# EAGLE design PCB board (EAGLE 9.5.2)
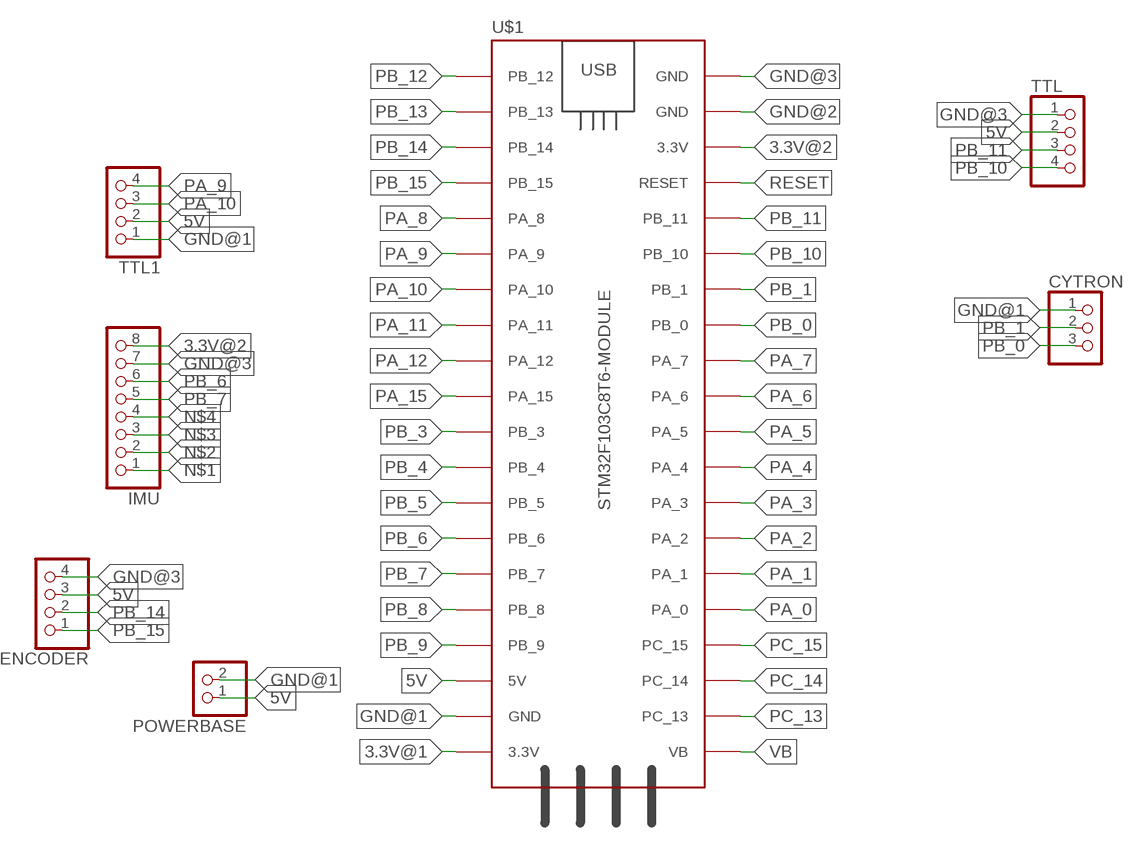
[diagram p0: schematic, sheet 1]

## Parts
CYTRON  PINHD-1X3  [1X03]
ENCODER  PINHD-4_DATA  [1X04_DATA]
IMU  PINHD-1X8  [1X08]
POWERBASE  PINHD-1X2  [1X02]
TTL  PINHD-4_DATA  [1X04_DATA]
TTL1  PINHD-4_DATA  [1X04_DATA]
U$1  STM32F103C8T6-MODULE  [STM32F103C8T6-MODULE]

## Nets
3.3V@1: U$1.3.3V_1(3.3V)
3.3V@2: IMU.8 U$1.3.3V_2(3.3V)
5V: ENCODER.3 POWERBASE.1 TTL1.2 TTL.2 U$1.5V
GND@1: CYTRON.1 POWERBASE.2 TTL1.1 U$1.GND_1(GND)
GND@2: U$1.GND_2(GND)
GND@3: ENCODER.4 IMU.7 TTL.1 U$1.GND_3(GND)
N$1: IMU.1
N$2: IMU.2
N$3: IMU.3
N$4: IMU.4
PA_0: U$1.PA_0
PA_1: U$1.PA_1
PA_2: U$1.PA_2
PA_3: U$1.PA_3
PA_4: U$1.PA_4
PA_5: U$1.PA_5
PA_6: U$1.PA_6
PA_7: U$1.PA_7
PA_8: U$1.PA_8
PA_9: TTL1.4 U$1.PA_9
PA_10: TTL1.3 U$1.PA_10
PA_11: U$1.PA_11
PA_12: U$1.PA_12
PA_15: U$1.PA_15
PB_0: CYTRON.3 U$1.PB_0
PB_1: CYTRON.2 U$1.PB_1
PB_3: U$1.PB_3
PB_4: U$1.PB_4
PB_5: U$1.PB_5
PB_6: IMU.6 U$1.PB_6
PB_7: IMU.5 U$1.PB_7
PB_8: U$1.PB_8
PB_9: U$1.PB_9
PB_10: TTL.4 U$1.PB_10
PB_11: TTL.3 U$1.PB_11
PB_12: U$1.PB_12
PB_13: U$1.PB_13
PB_14: ENCODER.2 U$1.PB_14
PB_15: ENCODER.1 U$1.PB_15
PC_13: U$1.PC_13
PC_14: U$1.PC_14
PC_15: U$1.PC_15
RESET: U$1.RESET
VB: U$1.VB

## Library data of the parts
CYTRON = MIA_LIBRARY-2-2-2:PINHD-1X3: PIN HEADER
ENCODER TTL TTL1 = MIA_LIBRARY-2-2-2:PINHD-4_DATA: PIN HEADER
IMU = MIA_LIBRARY-2-2-2:PINHD-1X8: PIN HEADER
POWERBASE = MIA_LIBRARY-2-2-2:PINHD-1X2: PIN HEADER
U$1 = MIA_LIBRARY-2-2-2:STM32F103C8T6-MODULE: STM32F103C8T6 module with ARM Cortex-3, 20kB SRAM, 64kB Flash, 72MHz

## Board
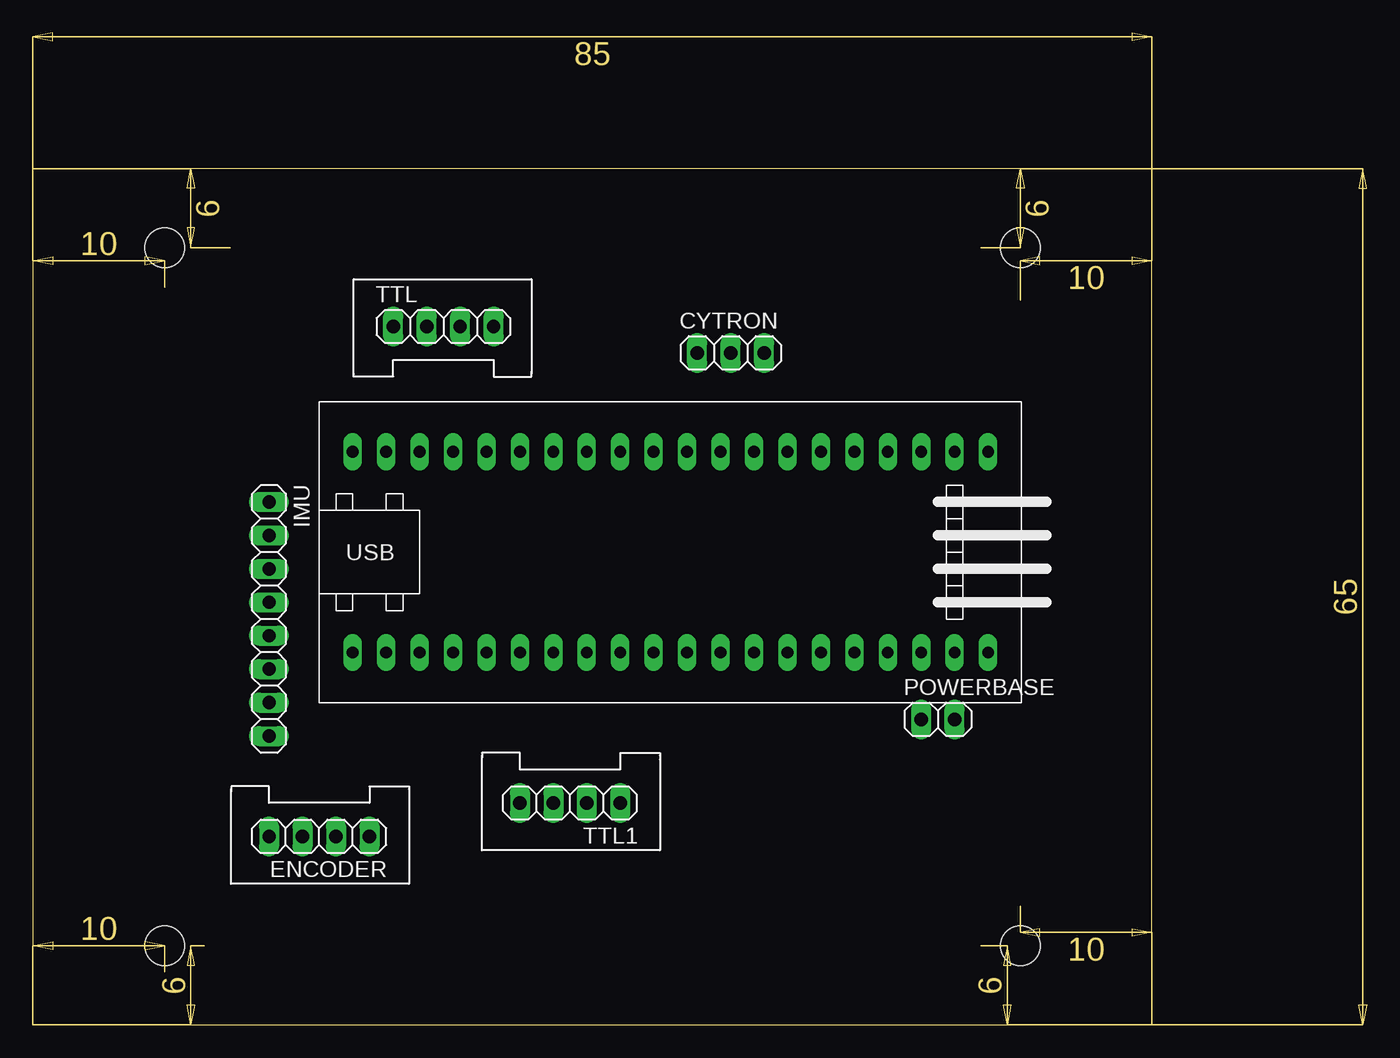
[diagram p1: board, top side]
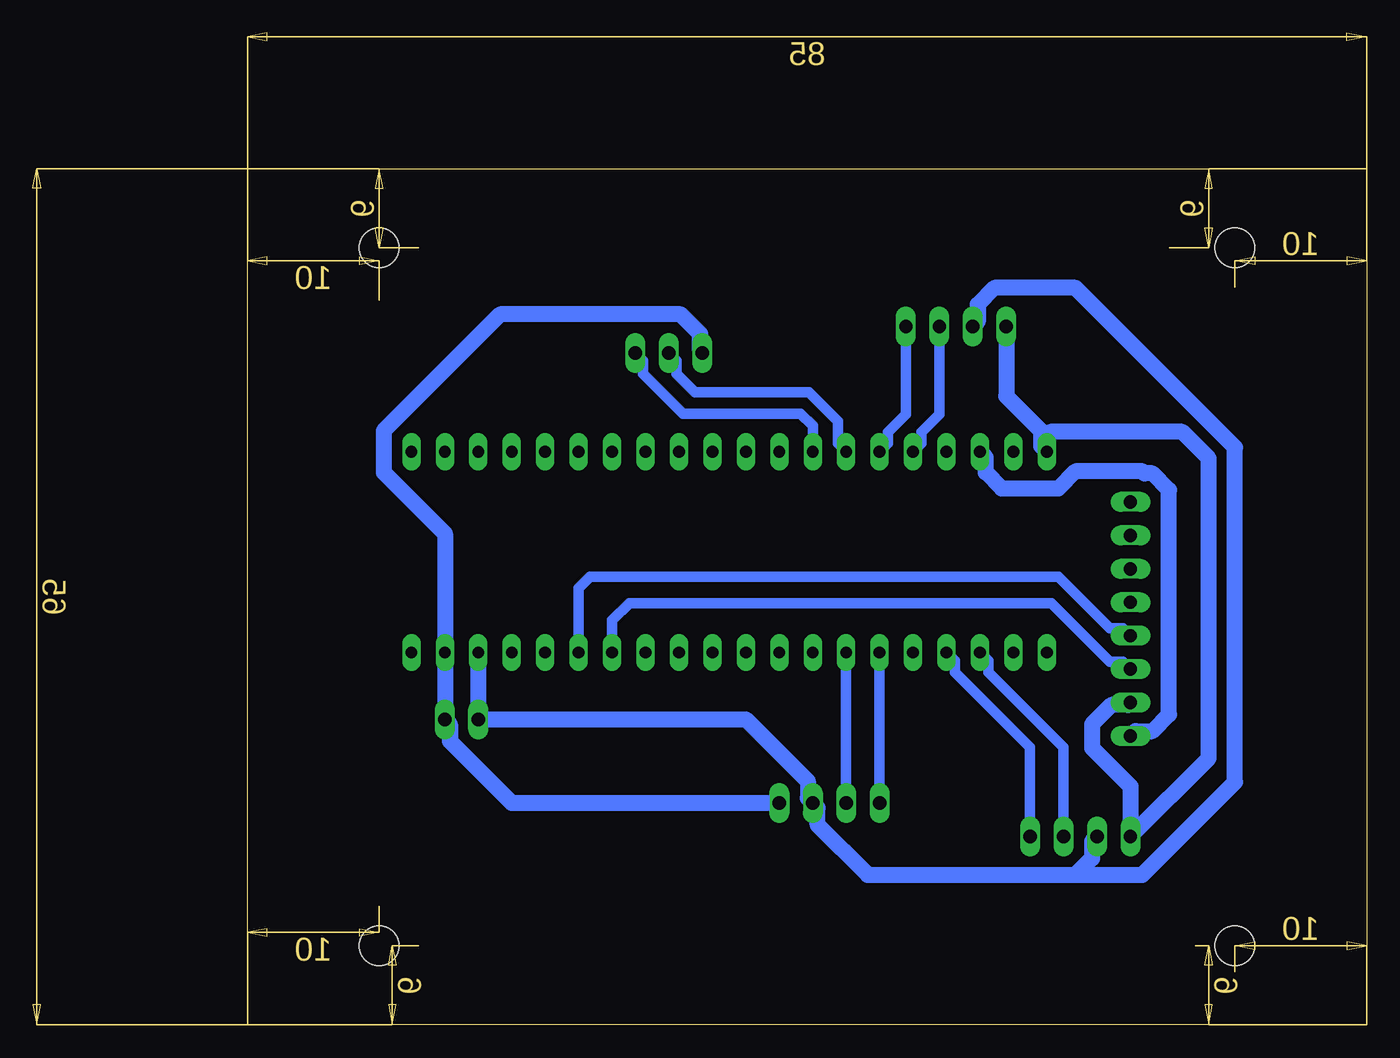
[diagram p2: board, bottom side, seen from below]

Size 85 x 65 mm. Coordinates in mm from the lower left corner, seen from the top.
Outline: 0,0 85,0 85,65 0,65 0,0
Copper layers (1*16): Top 0.035mm / dielectric 1.5mm / Bottom 0.035mm
Design rules "default *": minimum track width 0.8mm, minimum drill 0.35mm, track to track 0.8mm, track to pad 0.8mm, pad to pad 6mil, via to via 6mil, smd to smd 6mil, copper to edge 0.8mm, drill to drill 6mil, minimum pad ring 10mil, minimum via ring 8mil, stop-mask expansion 4mil, vias tented up to drill 0mil, thermal gap 10mil
Holes 3 mm at 75,59 10,59 75,6 10,6

### Footprints (pad centres in the part's own frame; a part is rotated, then mirrored left to right if it is on the bottom)
1X03 = drill 1.016 long: 1 -2.54,0; 2 0,0; 3 2.54,0
1X04_DATA = drill 1.016 long: 1 -3.81,0; 2 -1.27,0; 3 1.27,0; 4 3.81,0
1X08 = drill 1.016 long: 1 -8.89,0; 2 -6.35,0; 3 -3.81,0; 4 -1.27,0; 5 1.27,0; 6 3.81,0; 7 6.35,0; 8 8.89,0
1X02 = drill 1.016 long: 1 -1.27,0; 2 1.27,0
STM32F103C8T6-MODULE = drill 0.9 long: 3.3V_1 25.4,-7.62; 3.3V_2 -17.78,7.62; 5V 20.32,-7.62; GND_1 22.86,-7.62; GND_2 -20.32,7.62; GND_3 -22.86,7.62; PA_0 15.24,7.62; PA_1 12.7,7.62; PA_2 10.16,7.62; PA_3 7.62,7.62; PA_4 5.08,7.62; PA_5 2.54,7.62; PA_6 0,7.62; PA_7 -2.54,7.62; PA_8 -12.7,-7.62; PA_9 -10.16,-7.62; PA_10 -7.62,-7.62; PA_11 -5.08,-7.62; PA_12 -2.54,-7.62; PA_15 0,-7.62; PB_0 -5.08,7.62; PB_1 -7.62,7.62; PB_3 2.54,-7.62; PB_4 5.08,-7.62; PB_5 7.62,-7.62; PB_6 10.16,-7.62; PB_7 12.7,-7.62; PB_8 15.24,-7.62; PB_9 17.78,-7.62; PB_10 -10.16,7.62; PB_11 -12.7,7.62; PB_12 -22.86,-7.62; PB_13 -20.32,-7.62; PB_14 -17.78,-7.62; PB_15 -15.24,-7.62; PC_13 22.86,7.62; PC_14 20.32,7.62; PC_15 17.78,7.62; RESET -15.24,7.62; VB 25.4,7.62

### Placement (x,y rotation side)
CYTRON  53,51 0 top
ENCODER  21.75,14.29 180 top
IMU  17.94,30.8 270 top
POWERBASE  68.74,23.18 0 top
TTL  31.18,53.01 0 top
TTL1  40.8,16.83 180 top
U$1  47.15,35.88 0 top

### Tracks (layer width: path | path; a pad name or v marks a point on that pad's centre or on a via)
3.3V@2
  Bottom 1.2: IMU.8 17.56,22.29 16.28,22.29 15.02,23.55 15.02,40.59 16.28,41.85 16.85,41.85 17,42 22.11,42 23.42,40.69 27.7,40.69 28.93,41.92 28.93,43.06 U$1.3.3V_2
5V
  Bottom 1.2: U$1.5V POWERBASE.1 47.14,23.18 42.45,18.49 42.45,17.21 TTL1.2 41.69,16.45 41.69,15.17 37.89,11.37 22.12,11.37 | 22.12,11.37 20.86,12.63 20.86,13.91 ENCODER.3 | TTL.2 29.53,53.39 29.53,54.67 28.27,55.93 22.11,55.93 10,43.83 10,18.41 17.04,11.37 22.12,11.37
GND@1
  Bottom 1.2: TTL1.1 64.94,16.83 69.63,21.52 69.63,22.8 POWERBASE.2 U$1.GND_1 70.01,37.28 74.65,41.92 74.65,45.08 65.81,53.92 52.1,53.92 50.62,52.44 50.62,51.16 CYTRON.1
GND@3
  Bottom 1.2: IMU.7 18.1,24.29 19.38,24.29 20.86,22.81 20.86,21.01 17.94,18.09 ENCODER.4 12,20.23 12,43 14,45 24,45 24.29,44.71 U$1.GND_3 24.73,43.94 24.73,45.08 27.37,47.72 TTL.1
PA_9
  Bottom 0.8: TTL1.4 U$1.PA_9
PA_10
  Bottom 0.8: TTL1.3 U$1.PA_10
PB_0
  Bottom 0.8: CYTRON.3 54.96,50.42 54.96,49.42 51.94,46.4 43,46.4 42.07,45.47 U$1.PB_0
PB_1
  Bottom 0.8: CYTRON.2 52.42,50.42 52.42,49.42 51,48 42.34,48 40.17,45.83 40.17,44.14 U$1.PB_1
PB_6
  Bottom 0.8: IMU.6 18.52,27.57 19.52,27.57 23.95,32 56,32 57.31,30.69 U$1.PB_6
PB_7
  Bottom 0.8: IMU.5 18.52,30.11 19.52,30.11 23.41,34 59,34 59.85,33.15 U$1.PB_7
PB_10
  Bottom 0.8: U$1.PB_10 36.35,44.14 36.35,44.99 34.99,46.36 TTL.4
PB_11
  Bottom 0.8: U$1.PB_11 33.81,44.14 33.81,44.99 32.45,46.36 TTL.3
PB_14
  Bottom 0.8: U$1.PB_14 28.73,27.62 28.73,26.77 23.02,21.05 ENCODER.2
PB_15
  Bottom 0.8: U$1.PB_15 31.27,27.62 31.27,26.77 25.56,21.05 ENCODER.1